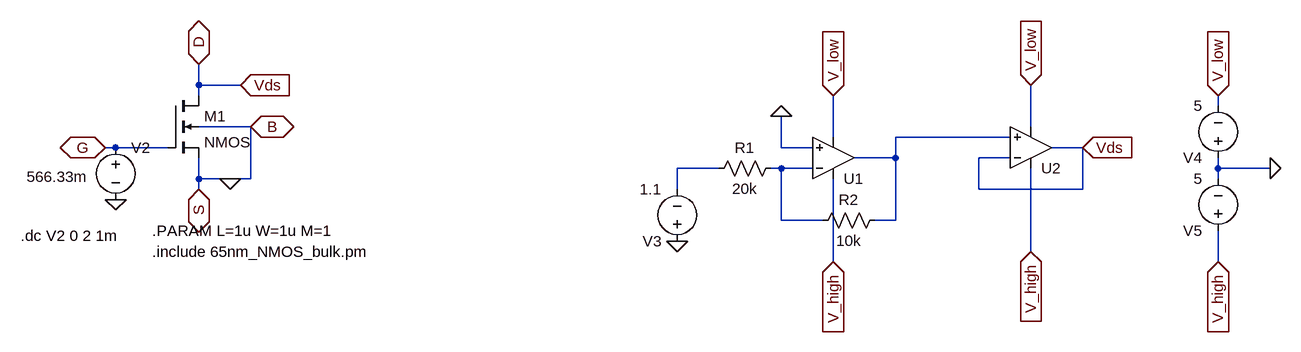
[diagram p0: schematic nmos65_trial2.asc]
nmos65_trial2.asc, the LTspice schematic file:
Version 4
SHEET 1 2100 680
WIRE 288 48 288 16
WIRE 352 48 288 48
WIRE 288 64 288 48
WIRE 1856 80 1856 64
WIRE 368 112 288 112
WIRE 1568 112 1568 48
WIRE 1264 128 1264 64
WIRE 1536 128 1360 128
WIRE 160 144 144 144
WIRE 240 144 160 144
WIRE 1184 144 1184 96
WIRE 1232 144 1184 144
WIRE 1648 144 1600 144
WIRE 1360 160 1360 128
WIRE 1360 160 1296 160
WIRE 1536 160 1488 160
WIRE 1088 176 1024 176
WIRE 1184 176 1168 176
WIRE 1232 176 1184 176
WIRE 1856 176 1856 160
WIRE 1936 176 1856 176
WIRE 288 192 288 160
WIRE 336 192 288 192
WIRE 368 192 368 112
WIRE 368 192 336 192
WIRE 1856 192 1856 176
WIRE 288 208 288 192
WIRE 1024 208 1024 176
WIRE 1488 208 1488 160
WIRE 1648 208 1648 144
WIRE 1648 208 1488 208
WIRE 1184 256 1184 176
WIRE 1248 256 1184 256
WIRE 1360 256 1360 160
WIRE 1360 256 1328 256
WIRE 1568 304 1568 176
WIRE 1264 320 1264 192
WIRE 1856 320 1856 272
FLAG 144 144 G
IOPIN 144 144 BiDir
FLAG 288 16 D
IOPIN 288 16 BiDir
FLAG 288 208 S
IOPIN 288 208 BiDir
FLAG 368 112 B
IOPIN 368 112 BiDir
FLAG 160 224 0
FLAG 336 192 0
FLAG 352 48 Vds
IOPIN 352 48 In
FLAG 1184 96 0
FLAG 1024 288 0
FLAG 1936 176 0
FLAG 1856 64 V_low
IOPIN 1856 64 In
FLAG 1856 320 V_high
IOPIN 1856 320 In
FLAG 1264 64 V_low
IOPIN 1264 64 In
FLAG 1568 48 V_low
IOPIN 1568 48 In
FLAG 1568 304 V_high
IOPIN 1568 304 In
FLAG 1264 320 V_high
IOPIN 1264 320 In
FLAG 1648 144 Vds
IOPIN 1648 144 In
SYMBOL nmos4 240 64 R0
SYMATTR InstName M1
SYMATTR Value2 l={L} w={W} ad='2*65n*{W}' as='2*65n*{W}' pd='2*(2*65n+{W})' ps='2*(2*65n+{W})' m={M}
SYMBOL voltage 160 128 R0
WINDOW 123 0 0 Left 0
WINDOW 39 0 0 Left 0
WINDOW 3 -137 61 Left 2
SYMATTR Value 566.33m
SYMATTR InstName V2
SYMBOL voltage 1024 304 R180
WINDOW 123 0 0 Left 0
WINDOW 39 0 0 Left 0
SYMATTR InstName V3
SYMATTR Value 1.1
SYMBOL res 1184 160 R90
WINDOW 0 0 56 VBottom 2
WINDOW 3 32 56 VTop 2
SYMATTR InstName R1
SYMATTR Value 20k
SYMBOL res 1344 240 R90
WINDOW 0 0 56 VBottom 2
WINDOW 3 32 56 VTop 2
SYMATTR InstName R2
SYMATTR Value 10k
SYMBOL voltage 1856 176 R180
WINDOW 123 0 0 Left 0
WINDOW 39 0 0 Left 0
SYMATTR InstName V4
SYMATTR Value 5
SYMBOL voltage 1856 288 R180
WINDOW 123 0 0 Left 0
WINDOW 39 0 0 Left 0
SYMATTR InstName V5
SYMATTR Value 5
SYMBOL Opamps\\UniversalOpamp2 1264 160 M180
SYMATTR InstName U1
SYMBOL Opamps\\UniversalOpamp2 1568 144 M180
SYMATTR InstName U2
TEXT 216 272 Left 2 !.PARAM L=1u W=1u M=1
TEXT 216 304 Left 2 !.include 65nm_NMOS_bulk.pm
TEXT 14 280 Left 2 !.dc V2 0 2 1m

The netlist it stands for:
* nmos65_trial2.asc
M1 Vds G 0 0 NMOS l={L} w={W} ad='2*65n*{W}' as='2*65n*{W}' pd='2*(2*65n+{W})' ps='2*(2*65n+{W})' m={M}
V2 G 0 566.33m
V3 0 N002 1.1
R1 N003 N002 20k
R2 N001 N003 10k
V4 0 V_low 5
V5 V_high 0 5
XU1 0 N003 V_high V_low N001 level.2 Avol=1Meg GBW=10Meg Slew=10Meg ilimit=25m rail=0 Vos=0 phimargin=45 en=0 enk=0 in=0 ink=0 Rin=500Meg  ; pins IN+ IN- V+ V- OUT
XU2 N001 Vds V_high V_low Vds level.2 Avol=1Meg GBW=10Meg Slew=10Meg ilimit=25m rail=0 Vos=0 phimargin=45 en=0 enk=0 in=0 ink=0 Rin=500Meg  ; pins IN+ IN- V+ V- OUT
.model NMOS NMOS
.model PMOS PMOS
.lib standard.mos
.PARAM L=1u W=1u M=1
.include 65nm_NMOS_bulk.pm
.dc V2 0 2 1m
.lib UniversalOpamps2.sub
.backanno
.end